# EAGLE design Blattdurchmesser (EAGLE 7.5.0)
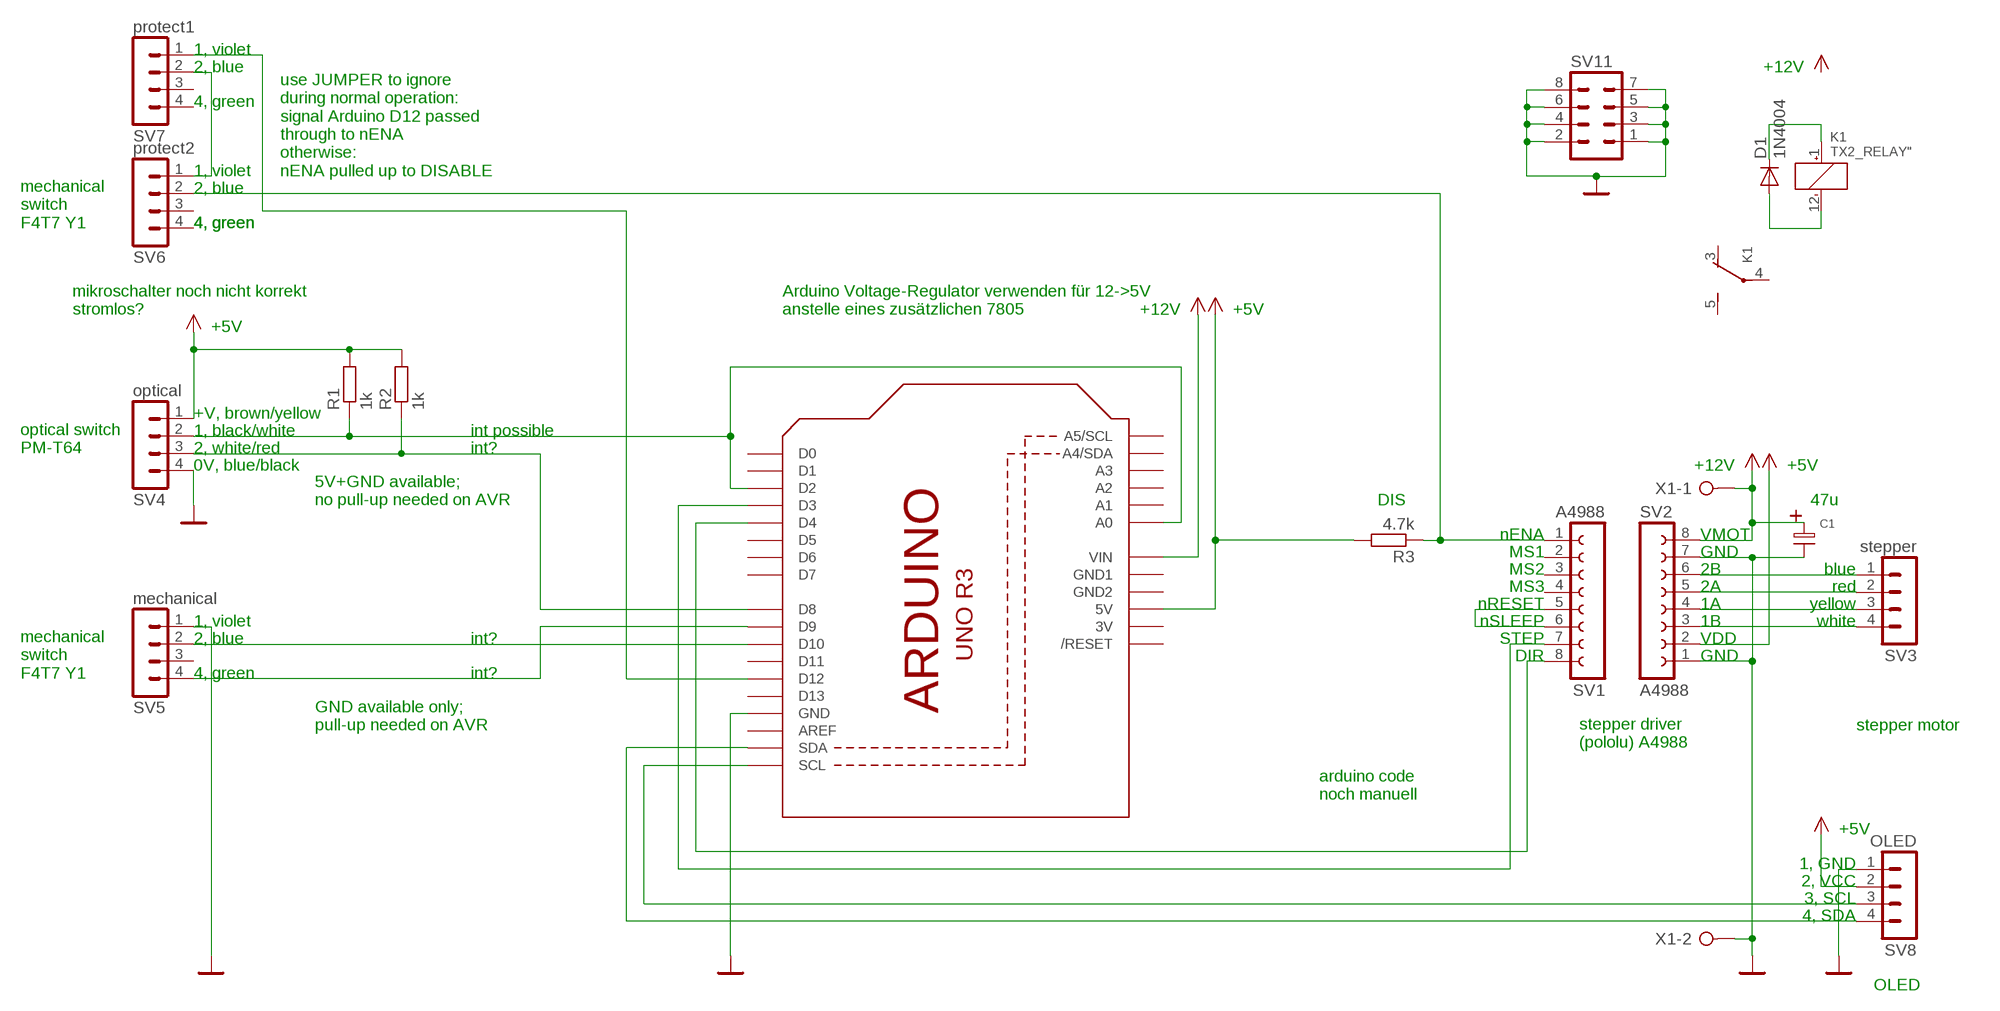
[diagram p0: schematic, sheet 1]

## Parts
C1  R_ELKO_8.1  [R_ELK_8.1]
D1  1N4004  [DO41-10]
K1  TX2_RELAY"  [TX2]
Q1  ARDUINOR3-NOIOREF-NOTEXT  [ARDUINOR3-NOTEXT-NOIOREF]
R1  1k  R-EU_0207/10  [0207/10]
R2  1k  R-EU_0207/10  [0207/10]
R3  4.7k  R-EU_0207/10  [0207/10]
SV1  A4988  FE08-1  [FE08]
SV2  A4988  FE08-1  [FE08]
SV3  stepper  MA04-1  [MA04-1]
SV4  optical  MA04-1  [MA04-1]
SV5  mechanical  MA04-1  [MA04-1]
SV6  protect2  MA04-1  [MA04-1]
SV7  protect1  MA04-1  [MA04-1]
SV8  OLED  MA04-1  [MA04-1]
SV11  MA04-2  [MA04-2]
X1  W237-02P  [W237-132]

## Nets
+5V: Q1.5V R1.2 R2.2 R3.2 SV2.2 SV4.1 SV8.2
+12V: C1.P Q1.VIN SV2.8 X1.1
GND: C1.N Q1.GND SV2.1 SV2.7 SV4.4 SV5.1 SV8.1 SV11.1 SV11.2 SV11.3 SV11.4 SV11.5 SV11.6 SV11.7 SV11.8 X1.2
N$1: Q1.D4 SV1.8
N$2: Q1.D3 SV1.7
N$3: SV2.6 SV3.1
N$4: SV2.5 SV3.2
N$5: SV2.4 SV3.3
N$6: SV2.3 SV3.4
N$7: SV1.5 SV1.6
N$8: D1.A K1.12(TX2_COIL:-)
N$9: Q1.D8 R2.1 SV4.3
N$10: SV6.1 SV7.2
N$11: Q1.D12 SV7.1
N$12: Q1.D10 SV5.2
N$13: Q1.D9 SV5.4
N$14: R3.1 SV1.1 SV6.2
N$15: Q1.A0 Q1.D2 R1.1 SV4.2
N$16: D1.C K1.1(TX2_COIL:+)
N$17: Q1.SCL SV8.3
N$18: Q1.SDA SV8.4
Unconnected: K1.3(TX2_SWITCH:O) K1.4(TX2_SWITCH:P) K1.5(TX2_SWITCH:S) K1.8(TX2_SWITCH2:S) K1.9(TX2_SWITCH2:P) K1.10(TX2_SWITCH2:O) Q1.A1 Q1.A2 Q1.A3 Q1.A4(A4/SDA) Q1.A5(A5/SCL) Q1.AREF Q1.D0 Q1.D1 Q1.D5 Q1.D6 Q1.D7 Q1.D11 Q1.D13 Q1.RESET(/RESET) SV1.2 SV1.3 SV1.4 SV5.3 SV6.3 SV6.4 SV7.3 SV7.4

## Notes on the sheet
- 1, violet
- 2, blue | +12V
- 4, green
- 1, violet
- use JUMPER to ignore
  during normal operation:
  signal Arduino D12 passed
  through to nENA
  otherwise:
  nENA pulled up to DISABLE
- 2, blue
- mechanical
  switch
  F4T7 Y1
- 4, green | 4, green
- mikroschalter noch nicht korrekt
  stromlos?
- Arduino Voltage-Regulator verwenden für 12->5V
  anstelle eines zusätzlichen 7805
- +12V | +5V
- +5V
- +V, brown/yellow
- 1, black/white | int possible
- optical switch
  PM-T64
- 2, white/red | int?
- 0V, blue/black | +12V | +5V
- 5V+GND available;
  no pull-up needed on AVR
- DIS | 47u
- nENA | VMOT
- MS1 | GND
- MS2 | 2B | blue
- MS3 | 2A | red
- nRESET | 1A | yellow
- 1, violet | nSLEEP | 1B | white
- 2, blue | int? | STEP | VDD
- DIR | GND
- mechanical
  switch
  F4T7 Y1
- 4, green | int?
- GND available only;
  pull-up needed on AVR
- stepper motor
- stepper driver
  (pololu) A4988
- arduino code
  noch manuell
- +5V
- 1, GND
- 2, VCC
- 3, SCL
- 4, SDA
- OLED

## Power pins joined to a net without a drawn wire
3V: Q1.3V
GND1: Q1.GND1
GND2: Q1.GND2

## Library data of the parts
C1 = Elkos:R_ELKO_8.1: 22µF & 47µF/ 63V, Radial Elko
D1 = diode:1N4004: DIODE general purpose rectifier, 1 A
K1 = relay:TX2_RELAY: TX2-Relay, 5 und 12 V, 2 Umschalter
Q1 = adafruit:ARDUINOR3-NOIOREF
R1-R3 = rcl:R-EU_: RESISTOR, European symbol
SV1 SV2 = con-lsta:FE08-1: FEMALE HEADER; OC_FARNELL: unknown; OC_NEWARK: unknown
SV3-SV8 = con-lstb:MA04-1: PIN HEADER; OC_FARNELL: unknown; OC_NEWARK: unknown
SV11 = con-lstb:MA04-2: PIN HEADER; OC_FARNELL: unknown; OC_NEWARK: unknown
X1 = con-wago-508:W237-02P: WAGO SREW CLAMP; OC_FARNELL: unknown; OC_NEWARK: unknown

## Board
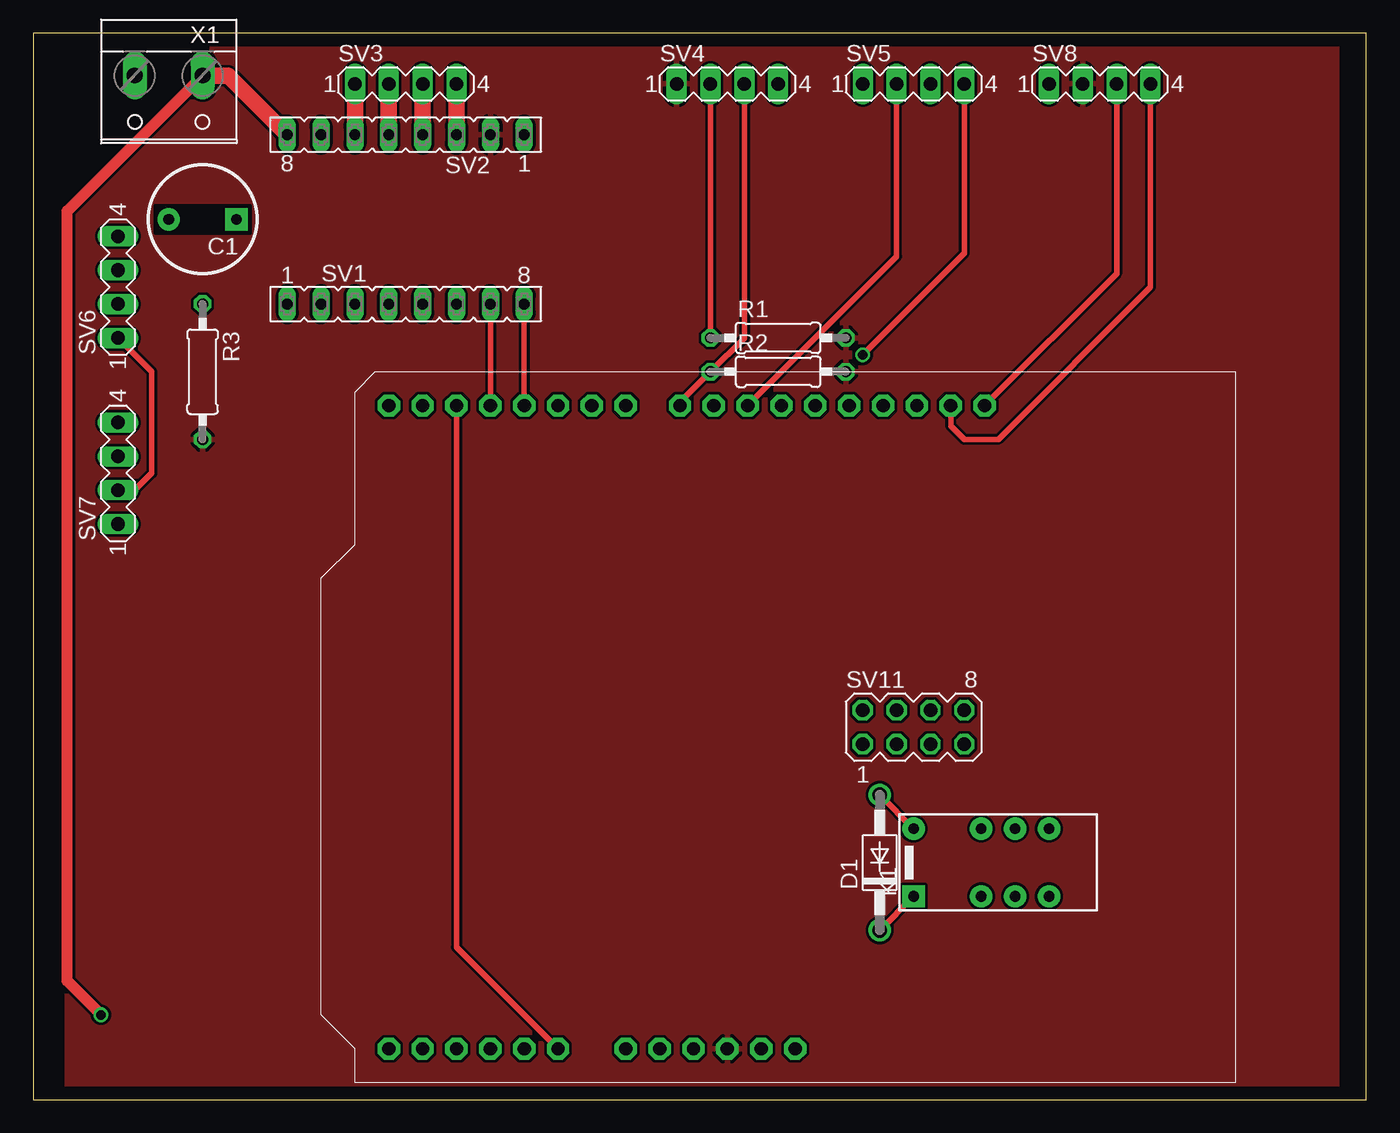
[diagram p1: board, top side]
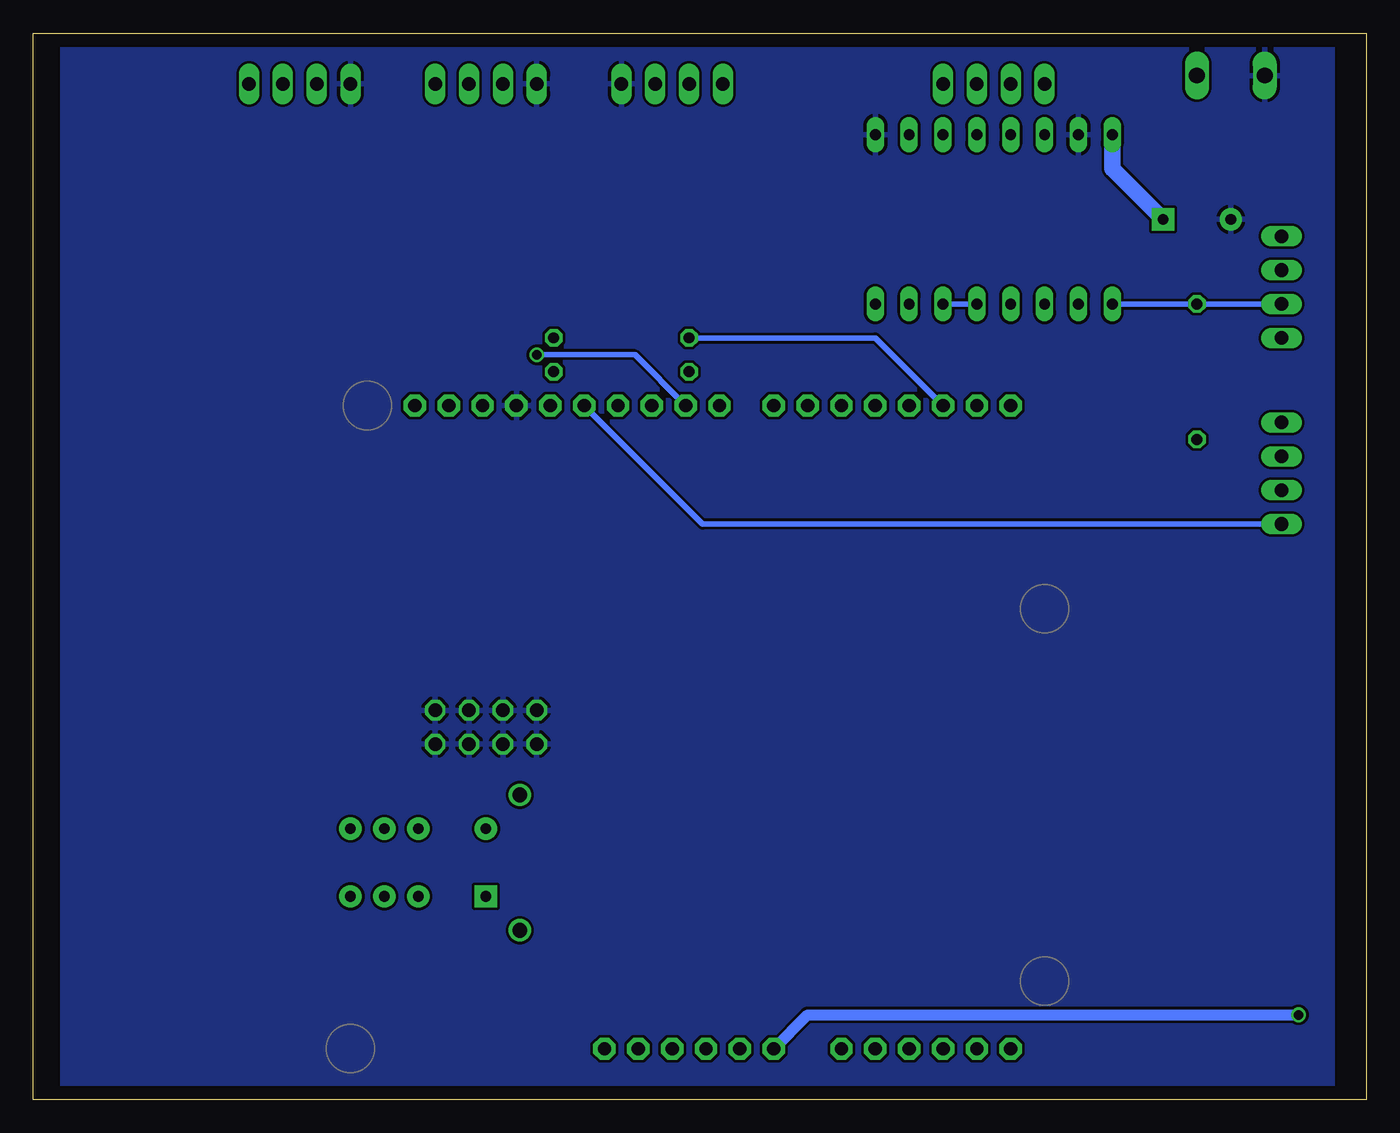
[diagram p2: board, bottom side, seen from below]

Size 100 x 80 mm. Coordinates in mm from the lower left corner, seen from the top.
Outline: 0,0 100,0 100,80 0,80 0,0
Copper layers (1*16): Top 0.035mm / dielectric 1.5mm / Bottom 0.035mm
Design rules "default": minimum track width 10mil, minimum drill 24mil, track to track 8mil, track to pad 8mil, pad to pad 8mil, via to via 8mil, smd to smd 8mil, copper to edge 40mil, drill to drill 8mil, minimum pad ring 10mil, minimum via ring 8mil, stop-mask expansion 4mil, vias tented up to drill 0mil, thermal gap 10mil

### Footprints (pad centres in the part's own frame; a part is rotated, then mirrored left to right if it is on the bottom)
R_ELK_8.1 = drill 0.8 pad 1.676: N 3.81,0 | drill 0.8 pad 1.676 square: P -1.27,0
DO41-10 = drill 1.118: A 5.08,0; C -5.08,0
TX2 = drill 0.8 pad 1.676 square: 1 -6.35,-2.54 | drill 0.8 pad 1.676: 3 -1.27,-2.54; 4 1.27,-2.54; 5 3.81,-2.54; 8 3.81,2.54; 9 1.27,2.54; 10 -1.27,2.54; 12 -6.35,2.54
ARDUINOR3-NOTEXT-NOIOREF = drill 1 pad 1.676 octagon: 3V 35.56,2.54; 5V 38.1,2.54; A0 50.8,2.54; A1 53.34,2.54; A2 55.88,2.54; A3 58.42,2.54; A4 60.96,2.54; A5 63.5,2.54; AREF 23.876,50.8; D0 63.5,50.8; D1 60.96,50.8; D2 58.42,50.8; D3 55.88,50.8; D4 53.34,50.8; D5 50.8,50.8; D6 48.26,50.8; D7 45.72,50.8; D8 41.656,50.8; D9 39.116,50.8; D10 36.576,50.8; D11 34.036,50.8; D12 31.496,50.8; D13 28.956,50.8; GND 26.416,50.8; GND1 43.18,2.54; GND2 40.64,2.54; RESET 33.02,2.54; SCL 18.796,50.8; SDA 21.336,50.8; VIN 45.72,2.54
0207/10 = drill 0.813 octagon: 1 -5.08,0; 2 5.08,0
FE08 = drill 0.813 long: 1 -8.89,0; 2 -6.35,0; 3 -3.81,0; 4 -1.27,0; 5 1.27,0; 6 3.81,0; 7 6.35,0; 8 8.89,0
MA04-1 = drill 1.016 long: 1 -3.81,0; 2 -1.27,0; 3 1.27,0; 4 3.81,0
MA04-2 = drill 1.016 octagon: 1 -3.81,-1.27; 2 -3.81,1.27; 3 -1.27,-1.27; 4 -1.27,1.27; 5 1.27,-1.27; 6 1.27,1.27; 7 3.81,-1.27; 8 3.81,1.27
W237-132 = drill 1.194 long: 1 -2.54,-0.635; 2 2.54,-0.635

### Placement (x,y rotation side)
C1  13.97,66.04 180 top
D1  63.5,17.78 90 top
K1  72.39,17.78 0 top
Q1  90.17,1.27 0 bottom
R1  55.88,57.15 0 top
R2  55.88,54.61 0 top
R3  12.7,54.61 270 top
SV1  27.94,59.69 0 top
SV2  27.94,72.39 180 top
SV3  27.94,76.2 0 top
SV4  52.07,76.2 0 top
SV5  66.04,76.2 0 top
SV6  6.35,60.96 90 top
SV7  6.35,46.99 90 top
SV8  80.01,76.2 0 top
SV11  66.04,27.94 0 top
X1  10.16,76.2 180 top

### Tracks (layer width: path | path; a pad name or v marks a point on that pad's centre or on a via)
+5V
  pour Top: 2.54,0 2.54,80.01 97.79,80.01 97.79,0
+12V  (via drill 0.7)
  Top 0.813: X1.1 2.54,66.67 2.54,8.89 v5.08,6.35
  Top 1.219: X1.1 14.61,76.83 SV2.8
  Bottom 0.813: Q1.VIN 41.91,6.35 v5.08,6.35
  Bottom 1.219: SV2.8 19.05,69.85 C1.P
GND
  pour Bottom: 2.54,80.01 97.79,80.01 97.79,0 2.54,0
N$1
  Top 0.406: SV1.8 Q1.D4
N$2
  Top 0.406: SV1.7 Q1.D3
N$3
  Top 1.219: SV3.1 SV2.6
N$4
  Top 1.219: SV3.2 SV2.5
N$5
  Top 1.219: SV3.3 SV2.4
N$6
  Top 1.219: SV3.4 SV2.3
N$7
  Bottom 0.406: SV1.5 SV1.6
N$8
  Top 0.406: D1.A K1.12
N$9
  Top 0.406: SV4.3 53.34,57.15 R2.1 48.51,52.32 Q1.D8
N$10
  Top 0.406: SV6.1 8.89,54.61 8.89,46.99 7.62,45.72 SV7.2
N$11
  Bottom 0.406: SV7.1 49.78,43.18 Q1.D12
N$12
  Top 0.406: Q1.D10 64.77,63.25 SV5.2
N$13  (via drill 0.7)
  Top 0.406: v62.23,55.88 69.85,63.5 SV5.4
  Bottom 0.406: Q1.D9 54.86,55.88 v62.23,55.88
N$14
  Bottom 0.406: SV1.1 R3.1 SV6.2
N$15
  Top 0.406: SV4.2 R1.1 | Q1.D2 31.75,11.43 Q1.A0
  Bottom 0.406: R1.1 36.83,57.15 Q1.D2
N$16
  Top 0.406: D1.C K1.1
N$17
  Top 0.406: SV8.3 81.28,61.98 Q1.SCL
N$18
  Top 0.406: SV8.4 83.82,60.96 72.39,49.53 69.85,49.53 68.83,50.55 Q1.SDA